# Altium schematic sheet Parallel Data Interface.SchDoc
size A4
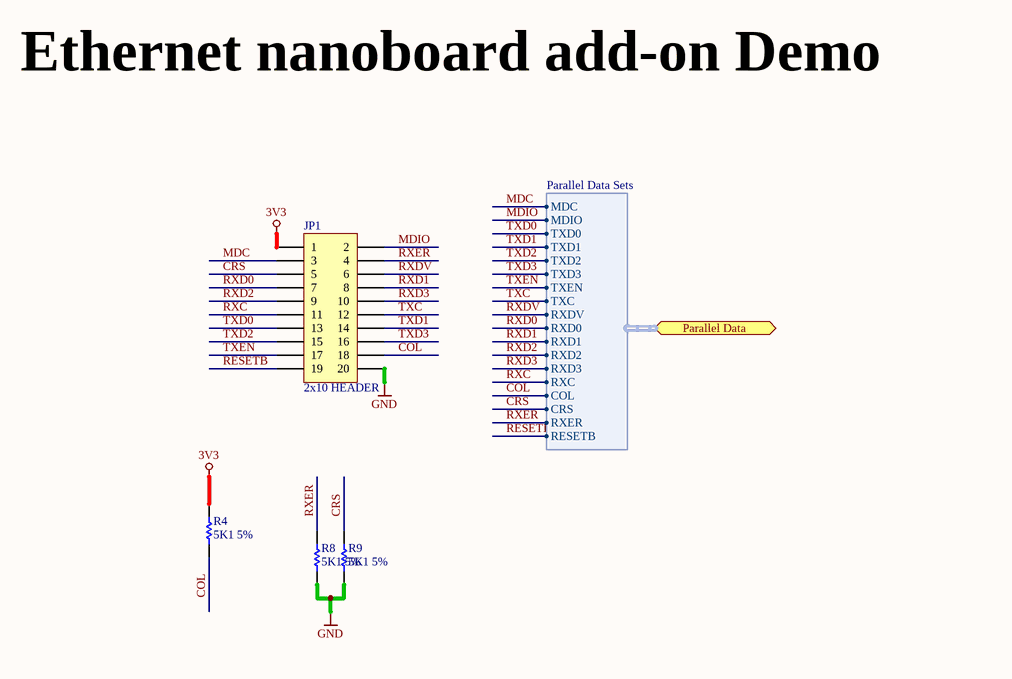
[diagram p0: Parallel Data Interface.SchDoc]

## Parts
JP1  2x10 HEADER  [HDR2X10]
R4  5K1 5%  [RESC2012]
R8  5K1 5%  [RESC2012]
R9  5K1 5%  [RESC2012]

## Ports
Parallel Data (harness Parallel Data Sets)

## Harnesses
Parallel Data Sets: MDC, MDIO, TXD0, TXD1, TXD2, TXD3, TXEN, TXC, RXDV, RXD0, RXD1, RXD2, RXD3, RXC, COL, CRS, RXER, RESETB

## Nets
3V3: JP1.1 R4.2
GND: JP1.20 R8.1 R9.1
COL: JP1.18 R4.1 ; port Parallel Data.COL
CRS: JP1.5 R9.2 ; port Parallel Data.CRS
MDC: JP1.3 ; port Parallel Data.MDC
MDIO: JP1.2 ; port Parallel Data.MDIO
RESETB: JP1.19 ; port Parallel Data.RESETB
RXC: JP1.11 ; port Parallel Data.RXC
RXD0: JP1.7 ; port Parallel Data.RXD0
RXD1: JP1.8 ; port Parallel Data.RXD1
RXD2: JP1.9 ; port Parallel Data.RXD2
RXD3: JP1.10 ; port Parallel Data.RXD3
RXDV: JP1.6 ; port Parallel Data.RXDV
RXER: JP1.4 R8.2 ; port Parallel Data.RXER
TXC: JP1.12 ; port Parallel Data.TXC
TXD0: JP1.13 ; port Parallel Data.TXD0
TXD1: JP1.14 ; port Parallel Data.TXD1
TXD2: JP1.15 ; port Parallel Data.TXD2
TXD3: JP1.16 ; port Parallel Data.TXD3
TXEN: JP1.17 ; port Parallel Data.TXEN

## Notes on the sheet
- Ethernet nanoboard add-on Demo
- Title
- Size:
- Date:
- A4
- Number:
- Time:
- Revision:
- Sheet
- of
- File:

## Library data of the parts
JP1 = CON-HDR-2x10-STR: Header, 10-Pin, Dual row
R4 R8 R9 = RES: Resistor